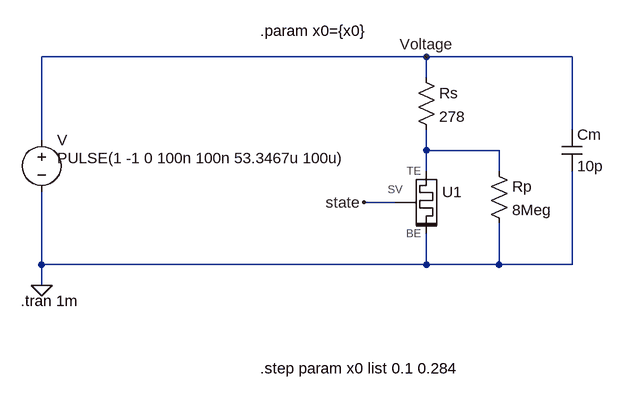
[diagram p0: schematic sine_input.asc]
sine_input.asc, the LTspice schematic file:
Version 4
SHEET 1 13136 680
WIRE 384 -160 -208 -160
WIRE 608 -160 384 -160
WIRE 384 -128 384 -160
WIRE 608 -48 608 -160
WIRE -208 -32 -208 -160
WIRE 384 -16 384 -48
WIRE 496 -16 384 -16
WIRE 384 16 384 -16
WIRE 496 16 496 -16
WIRE 336 64 288 64
WIRE -208 160 -208 48
WIRE 384 160 384 112
WIRE 384 160 -208 160
WIRE 496 160 496 96
WIRE 496 160 384 160
WIRE 608 160 608 16
WIRE 608 160 496 160
WIRE -208 192 -208 160
FLAG 288 64 state
FLAG -208 192 0
FLAG 384 -160 Voltage
SYMBOL res 368 -144 R0
SYMATTR InstName Rs
SYMATTR Value 278
SYMBOL res 480 0 R0
SYMATTR InstName Rp
SYMATTR Value 8Meg
SYMBOL voltage -208 -48 R0
WINDOW 123 0 0 Left 0
WINDOW 39 0 0 Left 0
WINDOW 3 24 44 Left 2
SYMATTR InstName V
SYMATTR Value PULSE(1 -1 0 100n 100n 53.3467u 100u)
SYMBOL Memristor 368 16 R0
SYMATTR InstName U1
SYMBOL cap 592 -48 R0
SYMATTR InstName Cm
SYMATTR Value 10p
TEXT 128 -200 Left 2 !.param x0={x0}
TEXT -240 216 Left 2 !.tran 1m
TEXT 128 320 Left 2 !.step param x0 list 0.1 0.284

The netlist it stands for:
* sine_input.asc
Rs Voltage N001 278
Rp N001 0 8Meg
V Voltage 0 PULSE(1 -1 0 100n 100n 53.3467u 100u)
XU1 N001 0 state MEM_NAMLAB_CORE  ; pins TE BE SV
Cm Voltage 0 10p
.param x0={x0}
.tran 1m
.step param x0 list 0.1 0.284
.lib MEM_NAMLAB_CORE.sub
.backanno
.end